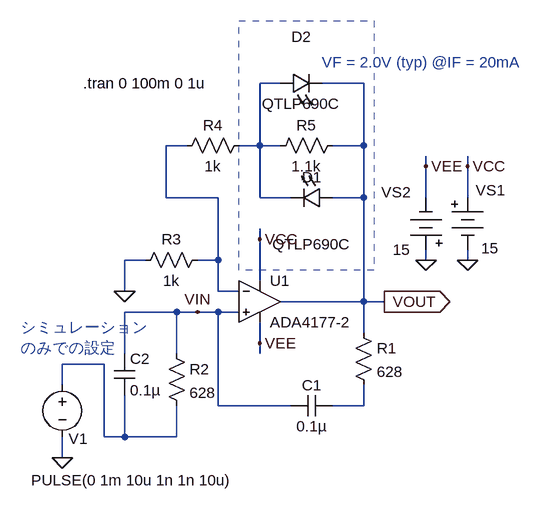
[diagram p0: schematic fig-01-03-06.asc]
fig-01-03-06.asc, the LTspice schematic file:
Version 4
SHEET 1 880 680
WIRE 240 -160 208 -160
WIRE 368 -160 304 -160
WIRE 96 -64 64 -64
WIRE 208 -64 208 -160
WIRE 208 -64 176 -64
WIRE 240 -64 208 -64
WIRE 368 -64 368 -160
WIRE 368 -64 320 -64
WIRE 464 -32 464 -48
WIRE 528 -32 528 -48
WIRE 64 16 64 -64
WIRE 144 16 64 16
WIRE 208 16 208 -64
WIRE 256 16 208 16
WIRE 368 16 368 -64
WIRE 368 16 320 16
WIRE 464 16 464 -32
WIRE 528 16 528 -32
WIRE 208 80 208 64
WIRE 32 112 0 112
WIRE 144 112 144 16
WIRE 144 112 112 112
WIRE 464 112 464 96
WIRE 528 112 528 96
WIRE 208 144 208 80
WIRE 0 160 0 112
WIRE 144 160 144 112
WIRE 176 160 144 160
WIRE 368 176 368 16
WIRE 368 176 240 176
WIRE 400 176 368 176
WIRE 80 192 0 192
WIRE 112 192 80 192
WIRE 144 192 112 192
WIRE 176 192 144 192
WIRE 368 224 368 176
WIRE 208 240 208 208
WIRE 0 256 0 192
WIRE 80 256 80 192
WIRE 208 256 208 240
WIRE -32 272 -96 272
WIRE -96 304 -96 272
WIRE 144 336 144 192
WIRE 256 336 144 336
WIRE 368 336 368 304
WIRE 368 336 320 336
WIRE -32 384 -32 272
WIRE 0 384 0 320
WIRE 0 384 -32 384
WIRE 80 384 80 336
WIRE 80 384 0 384
WIRE -96 416 -96 384
FLAG 464 112 0
FLAG 528 112 0
FLAG 0 160 0
FLAG -96 416 0
FLAG 400 176 VOUT
IOPIN 400 176 Out
FLAG 464 -32 VEE
FLAG 528 -32 VCC
FLAG 208 80 VCC
FLAG 208 240 VEE
FLAG 112 192 VIN
SYMBOL Misc\\battery 528 0 R0
WINDOW 0 13 5 Left 2
WINDOW 3 21 94 Left 2
SYMATTR InstName VS1
SYMATTR Value 15
SYMBOL Misc\\battery 464 112 R180
WINDOW 0 24 104 Left 2
WINDOW 3 24 16 Left 2
SYMATTR InstName VS2
SYMATTR Value 15
SYMBOL res 128 96 R90
WINDOW 0 0 56 VBottom 2
WINDOW 3 32 56 VTop 2
SYMATTR InstName R3
SYMATTR Value 1k
SYMBOL res 192 -80 R90
WINDOW 0 0 56 VBottom 2
WINDOW 3 32 56 VTop 2
SYMATTR InstName R4
SYMATTR Value 1k
SYMBOL voltage -96 288 R0
WINDOW 0 10 99 Left 2
WINDOW 3 -48 163 Left 2
WINDOW 123 0 0 Left 0
WINDOW 39 0 0 Left 0
SYMATTR InstName V1
SYMATTR Value PULSE(0 1m 10u 1n 1n 10u)
SYMBOL res 352 208 R0
SYMATTR InstName R1
SYMATTR Value 628
SYMBOL cap 320 320 R90
WINDOW 0 0 32 VBottom 2
WINDOW 3 32 32 VTop 2
SYMATTR InstName C1
SYMATTR Value 0.1µ
SYMBOL res 64 240 R0
SYMATTR InstName R2
SYMATTR Value 628
SYMBOL cap -16 256 R0
SYMATTR InstName C2
SYMATTR Value 0.1µ
SYMBOL LED 320 0 R90
WINDOW 0 0 32 VBottom 2
WINDOW 3 72 32 VTop 2
SYMATTR InstName D1
SYMATTR Value QTLP690C
SYMATTR Description Diode
SYMATTR Type diode
SYMBOL res 336 -80 R90
WINDOW 0 0 56 VBottom 2
WINDOW 3 32 56 VTop 2
SYMATTR InstName R5
SYMATTR Value 1.1k
SYMBOL LED 240 -144 R270
WINDOW 0 72 32 VTop 2
WINDOW 3 0 32 VBottom 2
SYMATTR InstName D2
SYMATTR Value QTLP690C
SYMATTR Description Diode
SYMATTR Type diode
SYMBOL Opamps\\ADA4177-2 208 176 R0
SYMATTR InstName U1
TEXT -64 -160 Left 2 !.tran 0 100m 0 1u
TEXT -160 216 Left 2 ;シミュレーション
TEXT -160 248 Left 2 ;のみでの設定
TEXT 304 -192 Left 2 ;VF = 2.0V (typ) @IF = 20mA
RECTANGLE Normal 384 128 176 -256 2

The netlist it stands for:
* fig-01-03-06.asc
VS1 VCC 0 15
VS2 0 VEE 15
R3 N002 0 1k
R4 N001 N002 1k
V1 N003 0 PULSE(0 1m 10u 1n 1n 10u)
R1 VOUT N004 628
C1 N004 VIN 0.1µ
R2 VIN N003 628
C2 VIN N003 0.1µ
D1 VOUT N001 QTLP690C
R5 VOUT N001 1.1k
D2 N001 VOUT QTLP690C
* U1: ADA4177-2 (symbol Opamps\ADA4177-2 not available, pins judged from their places): In+=VIN In-=N002 V+=VCC V-=VEE OUT=VOUT
.model D D
.lib standard.dio
.tran 0 100m 0 1u
* シミュレーション
* のみでの設定
* VF = 2.0V (typ) @IF = 20mA
.backanno
.end